# Altium schematic sheet 10_VO Interface_2.schdoc
size 309 x 223 mm; Symbol: Sheet-Symbol_A4; Device: Sheet-Symbol_A4; Company: 嘉立创EDA; Version: V1.0; Page Size: A4; @Project Name: RK3568核心板; @Page Count: 10; @Update Date: 2024-10-10; @Create Date: 2024-10-10; @Schematic Name: Schematic1; @Page No: 9; @Page Name: VO Interface_2; @Board Name: Board1; @Create Time: 11:14:23; @Update Time: 11:15:25
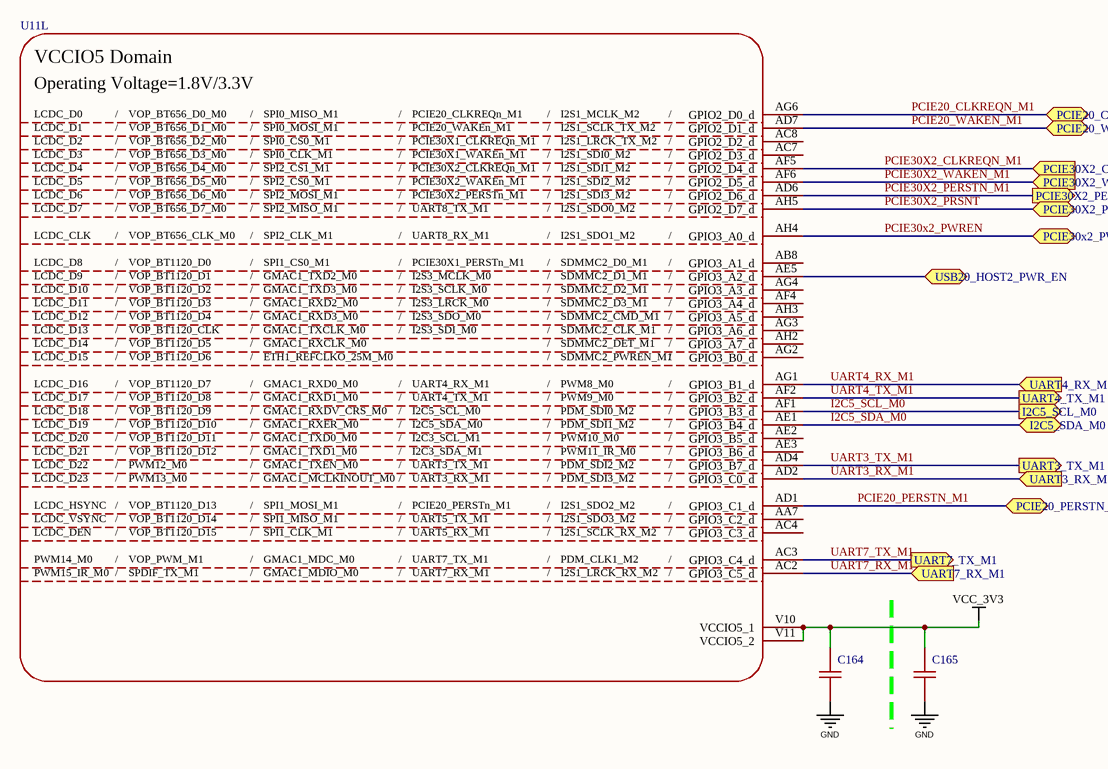
[diagram p0: 10_VO Interface_2.schdoc]

## Parts
C164  100nF  [C0201]  (value not drawn)
C165  1uF  [C0402]  (value not drawn)
U11  SOC_RK3568  [RK3568]  (value not drawn)  (part L of 23)

## Ports
I2C5_SCL_M0 (out), I2C5_SDA_M0 (bidir), PCIE20_CLKREQN_M1 (bidir), PCIE20_PERSTN_M1 (bidir), PCIE20_WAKEN_M1 (bidir), PCIE30X2_CLKREQN_M1 (in), PCIE30X2_PERSTN_M1 (out), PCIE30X2_PRSNT (bidir), PCIE30x2_PWREN (bidir), PCIE30X2_WAKEN_M1 (in), UART3_RX_M1 (in), UART3_TX_M1 (out), UART4_RX_M1 (in), UART4_TX_M1 (out), UART7_RX_M1 (in), UART7_TX_M1 (out), USB20_HOST2_PWR_EN (bidir)

## Nets
GND: C164.1 C165.1
VCC_3V3: C164.2 C165.2 U11.V10(VCCIO5_1) U11.V11(VCCIO5_2)
I2C5_SCL_M0: U11.AF1(GPIO3_B3_d) ; port I2C5_SCL_M0
I2C5_SDA_M0: U11.AE1(GPIO3_B4_d) ; port I2C5_SDA_M0
PCIE20_CLKREQN_M1: U11.AG6(GPIO2_D0_d) ; port PCIE20_CLKREQN_M1
PCIE20_PERSTN_M1: U11.AD1(GPIO3_C1_d) ; port PCIE20_PERSTN_M1
PCIE20_WAKEN_M1: U11.AD7(GPIO2_D1_d) ; port PCIE20_WAKEN_M1
PCIE30X2_CLKREQN_M1: U11.AF5(GPIO2_D4_d) ; port PCIE30X2_CLKREQN_M1
PCIE30X2_PERSTN_M1: U11.AD6(GPIO2_D6_d) ; port PCIE30X2_PERSTN_M1
PCIE30X2_PRSNT: U11.AH5(GPIO2_D7_d) ; port PCIE30X2_PRSNT
PCIE30x2_PWREN: U11.AH4(GPIO3_A0_d) ; port PCIE30x2_PWREN
PCIE30X2_WAKEN_M1: U11.AF6(GPIO2_D5_d) ; port PCIE30X2_WAKEN_M1
UART3_RX_M1: U11.AD2(GPIO3_C0_d) ; port UART3_RX_M1
UART3_TX_M1: U11.AD4(GPIO3_B7_d) ; port UART3_TX_M1
UART4_RX_M1: U11.AG1(GPIO3_B1_d) ; port UART4_RX_M1
UART4_TX_M1: U11.AF2(GPIO3_B2_d) ; port UART4_TX_M1
UART7_RX_M1: U11.AC2(GPIO3_C5_d) ; port UART7_RX_M1
UART7_TX_M1: U11.AC3(GPIO3_C4_d) ; port UART7_TX_M1
USB20_HOST2_PWR_EN: U11.AE5(GPIO3_A2_d) ; port USB20_HOST2_PWR_EN

Not connected (* = marked no-connect by the designer): U11 AA7(GPIO3_C2_d) AB8(GPIO3_A1_d) AC4(GPIO3_C3_d) AC7(GPIO2_D3_d) AC8(GPIO2_D2_d) AE2(GPIO3_B5_d) AE3(GPIO3_B6_d) AF4(GPIO3_A4_d) AG2(GPIO3_B0_d) AG3(GPIO3_A6_d) AG4(GPIO3_A3_d) AH2(GPIO3_A7_d) AH3(GPIO3_A5_d)

## Notes on the sheet
- 1
- 2
- 3
- 4
- 5
- 6
- A
- B
- C
- 原理图
- Schematic1
- 创建日期
- 更新日期
- 2024-10-10
- 审阅
- 绘制
- 图页
- VO Interface_2
- 物料编码
- RK3568核心板
- D
- 版本
- 尺寸
- 页
- 9
- 共
- 10
- V1.0
- A4
- 嘉立创EDA
- (in symbol SOC_RK3568, part L) VCCIO5 Domain; Operating Voltage=1.8V/3.3V; LCDC_D0; /; VOP_BT656_D0_M0; SPI0_MISO_M1; PCIE20_CLKREQn_M1; I2S1_MCLK_M2; LCDC_D1; VOP_BT656_D1_M0; SPI0_MOSI_M1; PCIE20_WAKEn_M1; I2S1_SCLK_TX_M2; LCDC_D2; VOP_BT656_D2_M0; SPI0_CS0_M1; PCIE30X1_CLKREQn_M1; I2S1_LRCK_TX_M2; LCDC_D3; VOP_BT656_D3_M0; SPI0_CLK_M1; PCIE30X1_WAKEn_M1; I2S1_SDI0_M2; LCDC_D4; VOP_BT656_D4_M0; SPI2_CS1_M1; PCIE30X2_CLKREQn_M1; I2S1_SDI1_M2; LCDC_D5; VOP_BT656_D5_M0; SPI2_CS0_M1; PCIE30X2_WAKEn_M1; I2S1_SDI2_M2; LCDC_D6; VOP_BT656_D6_M0; SPI2_MOSI_M1; PCIE30X2_PERSTn_M1; I2S1_SDI3_M2; LCDC_D7; VOP_BT656_D7_M0; SPI2_MISO_M1; UART8_TX_M1; I2S1_SDO0_M2; LCDC_CLK; VOP_BT656_CLK_M0; SPI2_CLK_M1; UART8_RX_M1; I2S1_SDO1_M2; LCDC_D8; VOP_BT1120_D0; SPI1_CS0_M1; PCIE30X1_PERSTn_M1; SDMMC2_D0_M1; LCDC_D9; VOP_BT1120_D1; GMAC1_TXD2_M0; I2S3_MCLK_M0; SDMMC2_D1_M1; LCDC_D10; VOP_BT1120_D2; GMAC1_TXD3_M0; I2S3_SCLK_M0; SDMMC2_D2_M1; LCDC_D11; VOP_BT1120_D3; GMAC1_RXD2_M0; I2S3_LRCK_M0; SDMMC2_D3_M1; LCDC_D12; VOP_BT1120_D4; GMAC1_RXD3_M0; I2S3_SDO_M0; SDMMC2_CMD_M1; LCDC_D13; VOP_BT1120_CLK; GMAC1_TXCLK_M0; I2S3_SDI_M0; SDMMC2_CLK_M1; LCDC_D14; VOP_BT1120_D5; GMAC1_RXCLK_M0; SDMMC2_DET_M1; LCDC_D15; VOP_BT1120_D6; ETH1_REFCLKO_25M_M0; SDMMC2_PWREN_M1; LCDC_D16; VOP_BT1120_D7; GMAC1_RXD0_M0; UART4_RX_M1; PWM8_M0; LCDC_D17; VOP_BT1120_D8; GMAC1_RXD1_M0; UART4_TX_M1; PWM9_M0; LCDC_D18; VOP_BT1120_D9; GMAC1_RXDV_CRS_M0; I2C5_SCL_M0; PDM_SDI0_M2; LCDC_D19; VOP_BT1120_D10; GMAC1_RXER_M0; I2C5_SDA_M0; PDM_SDI1_M2; LCDC_D20; VOP_BT1120_D11; GMAC1_TXD0_M0; I2C3_SCL_M1; PWM10_M0; LCDC_D21; VOP_BT1120_D12; GMAC1_TXD1_M0; I2C3_SDA_M1; PWM11_IR_M0; LCDC_D22; PWM12_M0; GMAC1_TXEN_M0; UART3_TX_M1; PDM_SDI2_M2; LCDC_D23; PWM13_M0; GMAC1_MCLKINOUT_M0; UART3_RX_M1; PDM_SDI3_M2; LCDC_HSYNC; VOP_BT1120_D13; SPI1_MOSI_M1; PCIE20_PERSTn_M1; I2S1_SDO2_M2; LCDC_VSYNC; VOP_BT1120_D14; SPI1_MISO_M1; UART5_TX_M1; I2S1_SDO3_M2; LCDC_DEN; VOP_BT1120_D15; SPI1_CLK_M1; UART5_RX_M1; I2S1_SCLK_RX_M2; PWM14_M0; VOP_PWM_M1; GMAC1_MDC_M0; UART7_TX_M1; PDM_CLK1_M2; PWM15_IR_M0; SPDIF_TX_M1; GMAC1_MDIO_M0; UART7_RX_M1; I2S1_LRCK_RX_M2

## Library data of the parts
C164 = CL03A104KO3NNNC: 容值:100nF;精度:±10%;额定电压:16V;材质(温度系数):X5R;; Manufacturer: SAMSUNG(三星); Add into BOM: yes; Tolerance: ±10%; Voltage Rated: 16V; Temperature Coefficient: X5R; Symbol: CL03A104KO3NNNC; Device: CL03A104KO3NNNC; LCSC Part Name: 100nF ±10% 16V; Supplier Part: C307380; Manufacturer Part: CL03A104KO3NNNC; Supplier Footprint: 0201; JLCPCB Part Class: 扩展库; Datasheet: https://atta.szlcsc.com/upload/public/pdf/source/20160218/1457707763339.pdf; Supplier: LCSC; Convert to PCB: yes; Value: 100nF
C165 = CL05A105KA5NQNC: 容值:1uF;精度:±10%;额定电压:25V;材质(温度系数):X5R;; Manufacturer: SAMSUNG(三星); Add into BOM: yes; Tolerance: ±10%; Voltage Rated: 25V; Temperature Coefficient: X5R; Symbol: CL05A105KA5NQNC; Device: CL05A105KA5NQNC; LCSC Part Name: 1uF ±10% 25V; Supplier Part: C52923; Manufacturer Part: CL05A105KA5NQNC; Supplier Footprint: 0402; JLCPCB Part Class: 基础库; Datasheet: https://atta.szlcsc.com/upload/public/pdf/source/20160218/1457707763339.pdf; Supplier: LCSC; Convert to PCB: yes; Value: 1uF
U11 = SOC_RK3568: Part Reference: U1000; Manufacturer: Rockchip (瑞芯微); PCB footprint: BGA636_19R00X19R00X1R20; SWAP_INFO: (S1+S2+S3+S4+S5+S6+S7+S8+S9+S10+S11+S12+S13+S14+S15+S16+S17+S18+S19+S20+S21+S22+S23); SPLIT_INST: TRUE; Value: RK3568; Priority: A; Add into BOM: yes; Relevance: []; Symbol: SOC_RK3568; Device: SOC_RK3568; RK PN: RK3568; Part Type: SOC; Manufacturer PN: RK3568; Created by: JJJ; Origin Footprint 2: BGA636_19R00X19R00X1R20; Convert to PCB: yes